# Altium schematic sheet 907 PowerSupply.SchDoc: Electro-Sketch
size A4; Date: FIXED DATE; ApprovedBy: ABB; CheckedBy: CHECKED; Author: AUTHOR; CompanyName: COMPANY; DrawnBy: DRAWN BY; Engineer: ENGInEER; Organization: ORGANIZATION; Address1: add1; Address2: add2; Address3: add3; Address4: add4; DocumentNumber: LCL_018; Revision: 0; SheetNumber: 1; SheetTotal: 1; CurrentTime: TIME; CurrentDate: DATE; Time: TIME; DocumentFullPathAndName: FULL PATH NAME; DocumentName: DOC NAME; ModifiedDate: MODOFIED; ProjectName: PROJECT; Application_BuildNumber: AB
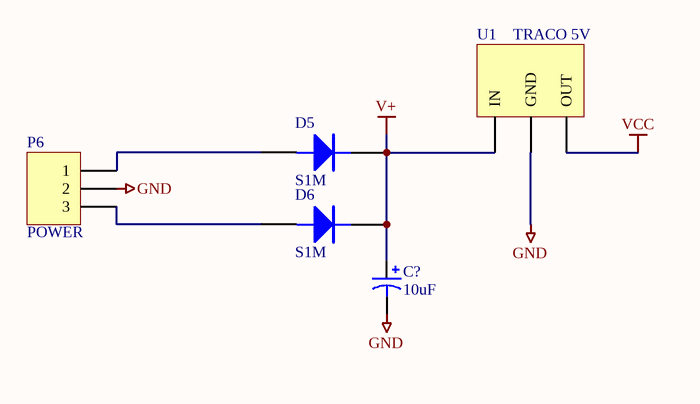
[diagram p0: 907 PowerSupply.SchDoc]

## Parts
C?  10uF  [CAPACITOR 12.5X20]
D5  S1M  [DO-214AC]
D6  S1M  [DO-214AC]
P6  POWER  [power]
U1  TRACO 5V  [TRACO TSR 1-2450]

## Nets
GND: C?.2 P6.2 U1.2(GND)
V+: C?.1 D5.2(K) D6.2(K) U1.1(IN)
VCC: U1.3(OUT)
NetD5_1: D5.1(A) P6.1
NetD6_1: D6.1(A) P6.3

## Notes on the sheet
- LOW COST LABS
- Title
- Size:
- Date:
- A4
- Number:
- Revision:
- Sheet
- of
- File:

## Library data of the parts
C? = Cap Pol1: Polarized Capacitor (Radial); Value: 10uF; LCSC Part No.: C190964
D5 D6 = DIODE S1M (DO-214AC): DIODE, POWER; Manufacturer: Taiwan Semiconductor; Mouser Part no.: 821-S1M; Farnell Part no.: 9843841; Manufacturer Part No.: S1M; Web link: http://au.mouser.com/Search/Refine.aspx?Keyword=821-S1M
P6 = Header 3: Header, 3 Pin; Manufacturer: FCI; Manufacturer Part No.: 68020-102; Mouser Part no.: 649-68020-102; Web link: http://au.mouser.com/ProductDetail/FCI/68020-102/?qs=sGAEpiMZZMs%252bGHln7q6pm44kDepmYTI87r6%2fnQtKGLI%3d
U1 = TRACO 1-2450: TRACO BUCK 1-2450 MODULE (5V)